# EAGLE design rc (EAGLE 8.0.0)
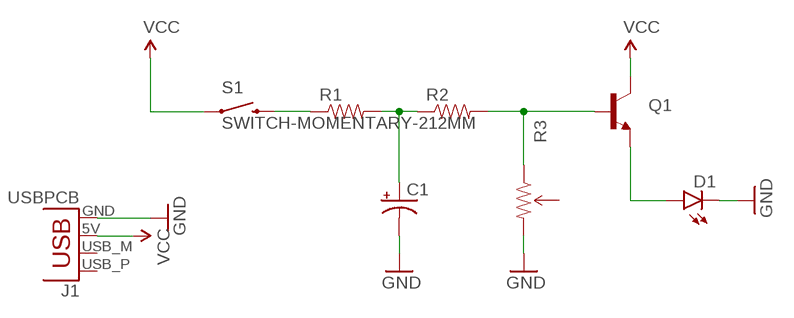
[diagram p0: schematic, sheet 1]

## Parts
C1  CAP_POLPTH1  [CPOL-RADIAL-100UF-25V]
D1  LED5MM  [LED5MM]
J1  USBPCB  [USB-A-PCB]
Q1  TRANSISTOR_NPNP2N2222A  [TO-92]
R1  RESISTORPTH-1/6W  [1/6W-RES]
R2  RESISTORPTH-1/6W  [1/6W-RES]
R3  TRIMPOTPTH  [TRIM_POT_PTH]
S1  SWITCH-MOMENTARY-212MM  [TACTILE-PTH-12MM]

## Nets
GND: C1.2(-) D1.K(C) J1.GND R3.3(CW)
N$1: D1.A Q1.3(E)
N$2: Q1.2(B) R2.2 R3.1(CCW)
N$3: C1.1(+) R1.2 R2.1
N$4: R1.1 S1.3
VCC: J1.5V(VBUS) Q1.1(C) S1.1
Unconnected: J1.USB_M(D-) J1.USB_P(D+) R3.2(WIPER)

## Library data of the parts
C1 = SparkFun-Capacitors:CAP_POL: Capacitor Polarized These are standard SMD and PTH capacitors. Normally 10uF, 47uF, and 100uF in electrolytic and tantalum varieties. Always verify the external diameter of the through hole cap, it varies with capacity, voltage, and manufacturer. The EIA devices should be standard.
D1 = SparkFun-LED:LED: LEDs Standard schematic elements and footprints for 5mm, 3mm, 1206, and 0603 sized LEDs. 5mm - Spark Fun Electronics SKU : COM-00529 (and others)
J1 = SparkFun-Connectors:USB: USB Connectors USB-B-PTH is fully proven SKU : PRT-00139/CONN-08278 USB-miniB is fully proven SKU : PRT-00587 USB-A-PCB is untested. USB-A-H is throughly reviewed, but untested. Spark Fun Electronics SKU : PRT-00437 USB-B-SMT is throughly reviewed, but untested. Needs silkscreen touching up. USB-A-S has not been used/tested USB-MB-H has not been used/tested USB-MICROB has been used. CONN-09505
Q1 = SparkFun-DiscreteSemi:TRANSISTOR_NPN: Generic NPN BJT MMBT2222A - TRANS-08049 (SOT-23, 1A 40V) MPSA42 - TRANS-09116 (SOT-23, 500mA 300V) MMBT5088LT1G - TRANS-11160 (SOT-23, 50 mA 30V) BC547 - COM-08928 <http://www.sparkfun.com/products/8928> (TO-92 45V 100mA) (1.Collector 2.Base 3.Emitter) 2N3904 - COM-00521 <http://www.sparkfun.com/products/521> (TO-92 40V 200mA) (1.Emitter 2.Base 3.Collector) P2N2222A - COM-12852 <http://www.sparkfun.com/products/12852> (TO-92 40V 600mA) (1.Collector 2.Base 3.Emitter); PROD_ID: TRANS-09536
R1 R2 = SparkFun-Resistors:RESISTOR: Resistor Basic schematic elements and footprints for 0603, 1206, and PTH resistors.
R3 = SparkFun-Electromechanical:TRIMPOT: Various small potentiometers for "set-and-forget" applications
S1 = SparkFun-Electromechanical:SWITCH-MOMENTARY-2: Various NO switches- pushbuttons, reed, etc; PROD_ID: SWCH-09185

## Board
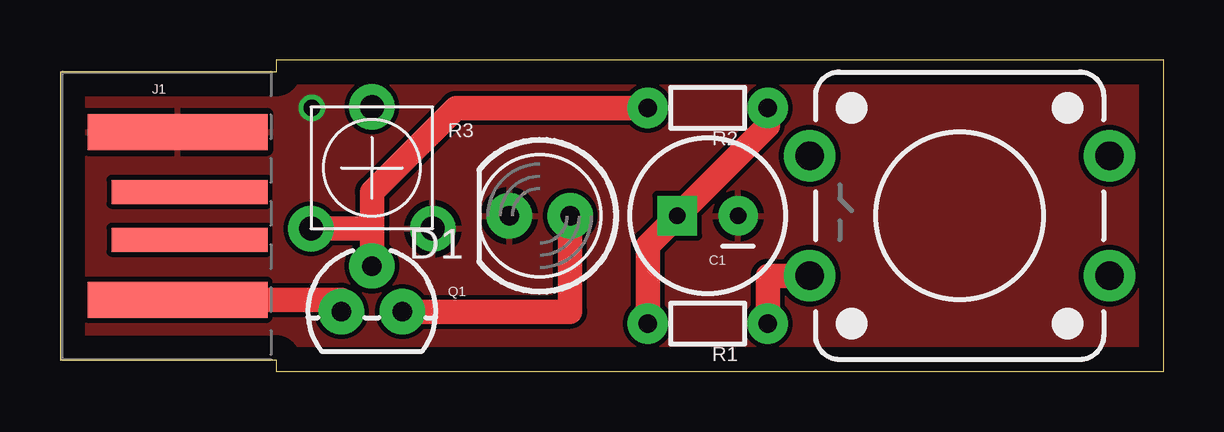
[diagram p1: board, top side]
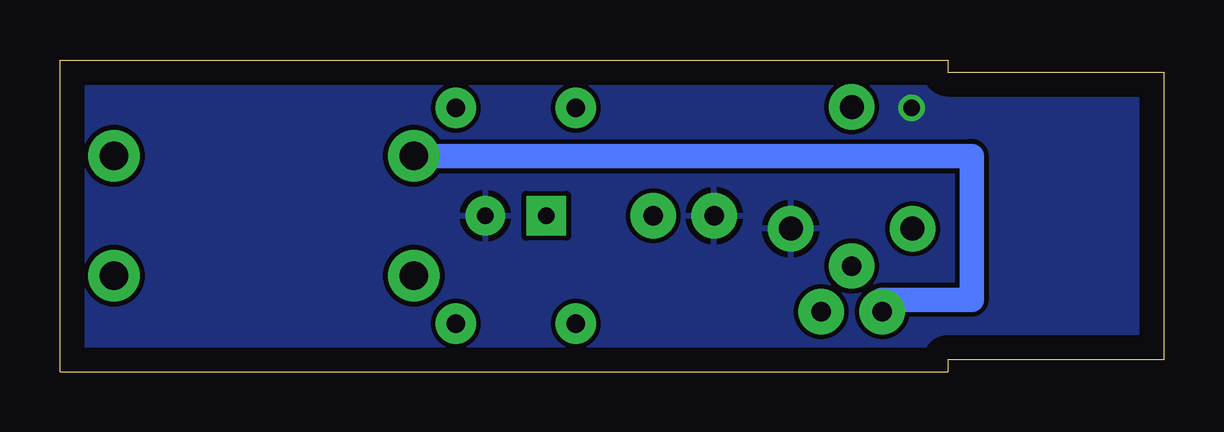
[diagram p2: board, bottom side, seen from below]

Size 46 x 13 mm. Coordinates in mm from the lower left corner, seen from the top.
Outline: 0,0.5 9,0.5 9,0 46,0 46,13 9,13 9,12.5 0,12.5 0,0.5
Copper layers (1*16): Top 0.035mm / dielectric 1.5mm / Bottom 0.035mm
Design rules "default": minimum track width 10mil, minimum drill 24mil, track to track 8mil, track to pad 8mil, pad to pad 8mil, via to via 8mil, smd to smd 8mil, copper to edge 40mil, drill to drill 8mil, minimum pad ring 10mil, minimum via ring 8mil, stop-mask expansion 4mil, vias tented up to drill 0mil, thermal gap 10mil

### Footprints (pad centres in the part's own frame; a part is rotated, then mirrored left to right if it is on the bottom)
CPOL-RADIAL-100UF-25V = drill 0.7 pad 1.651 square: 1 1.27,0 | drill 0.7 pad 1.651: 2 -1.27,0
LED5MM = drill 0.813 pad 1.88: A -1.27,0; K 1.27,0
USB-A-PCB = smd 7.5 x 1.5: 5V -0.2,-3.5; GND -0.2,3.5 | smd 6.5 x 1: USB_M 0.3,-1; USB_P 0.3,1
TO-92 = drill 0.813 pad 1.88: 1 -1.27,0; 2 0,1.905; 3 1.27,0
1/6W-RES = drill 0.762 pad 1.676: 1 -2.5,0; 2 2.5,0
TRIM_POT_PTH = drill 1 pad 1.88: 1 -2.54,-2.54; 2 0,2.54; 3 2.54,-2.54
TACTILE-PTH-12MM = drill 1.2 pad 2.159: 1 6.25,-2.5; 2 -6.25,-2.5; 3 6.25,2.5; 4 -6.25,2.5

### Placement (x,y rotation side)
C1  27,6.5 180 top
D1  20,6.5 180 top
J1  5.1,6.5 0 top
Q1  13,2.5 0 top
R1  27,2 180 top
R2  27,11 180 top
R3  13,8.5 0 top
S1  37.5,6.5 180 top

### Tracks (layer width: path | path; a pad name or v marks a point on that pad's centre or on a via)
GND  (via drill 0.7)
  other vias: 10.5,11
  pour Top: 0,13 0,0 46,0 46,13
  pour Bottom: 0,13 0,0 46,0 46,13
N$1
  Top 1.016: Q1.3 21.27,2.5 D1.A
N$2
  Top 1.016: 13,5.96 R3.1 | 13,5.96 Q1.2 | R2.2 16.5,11 13,7.5 13,5.96
N$3
  Top 1.016: R1.2 24.5,5.27 C1.1 29.5,10.27 R2.1
N$4
  Top 1.016: R1.1 29.5,4 S1.3
VCC
  Top 1.016: J1.5V 11.73,3 Q1.1
  Bottom 1.016: S1.1 8,9 8,3 11.73,3 Q1.1